# Altium schematic sheet Ctrl_board.SchDoc
size A3; SheetNumber: 1; SheetTotal: 1
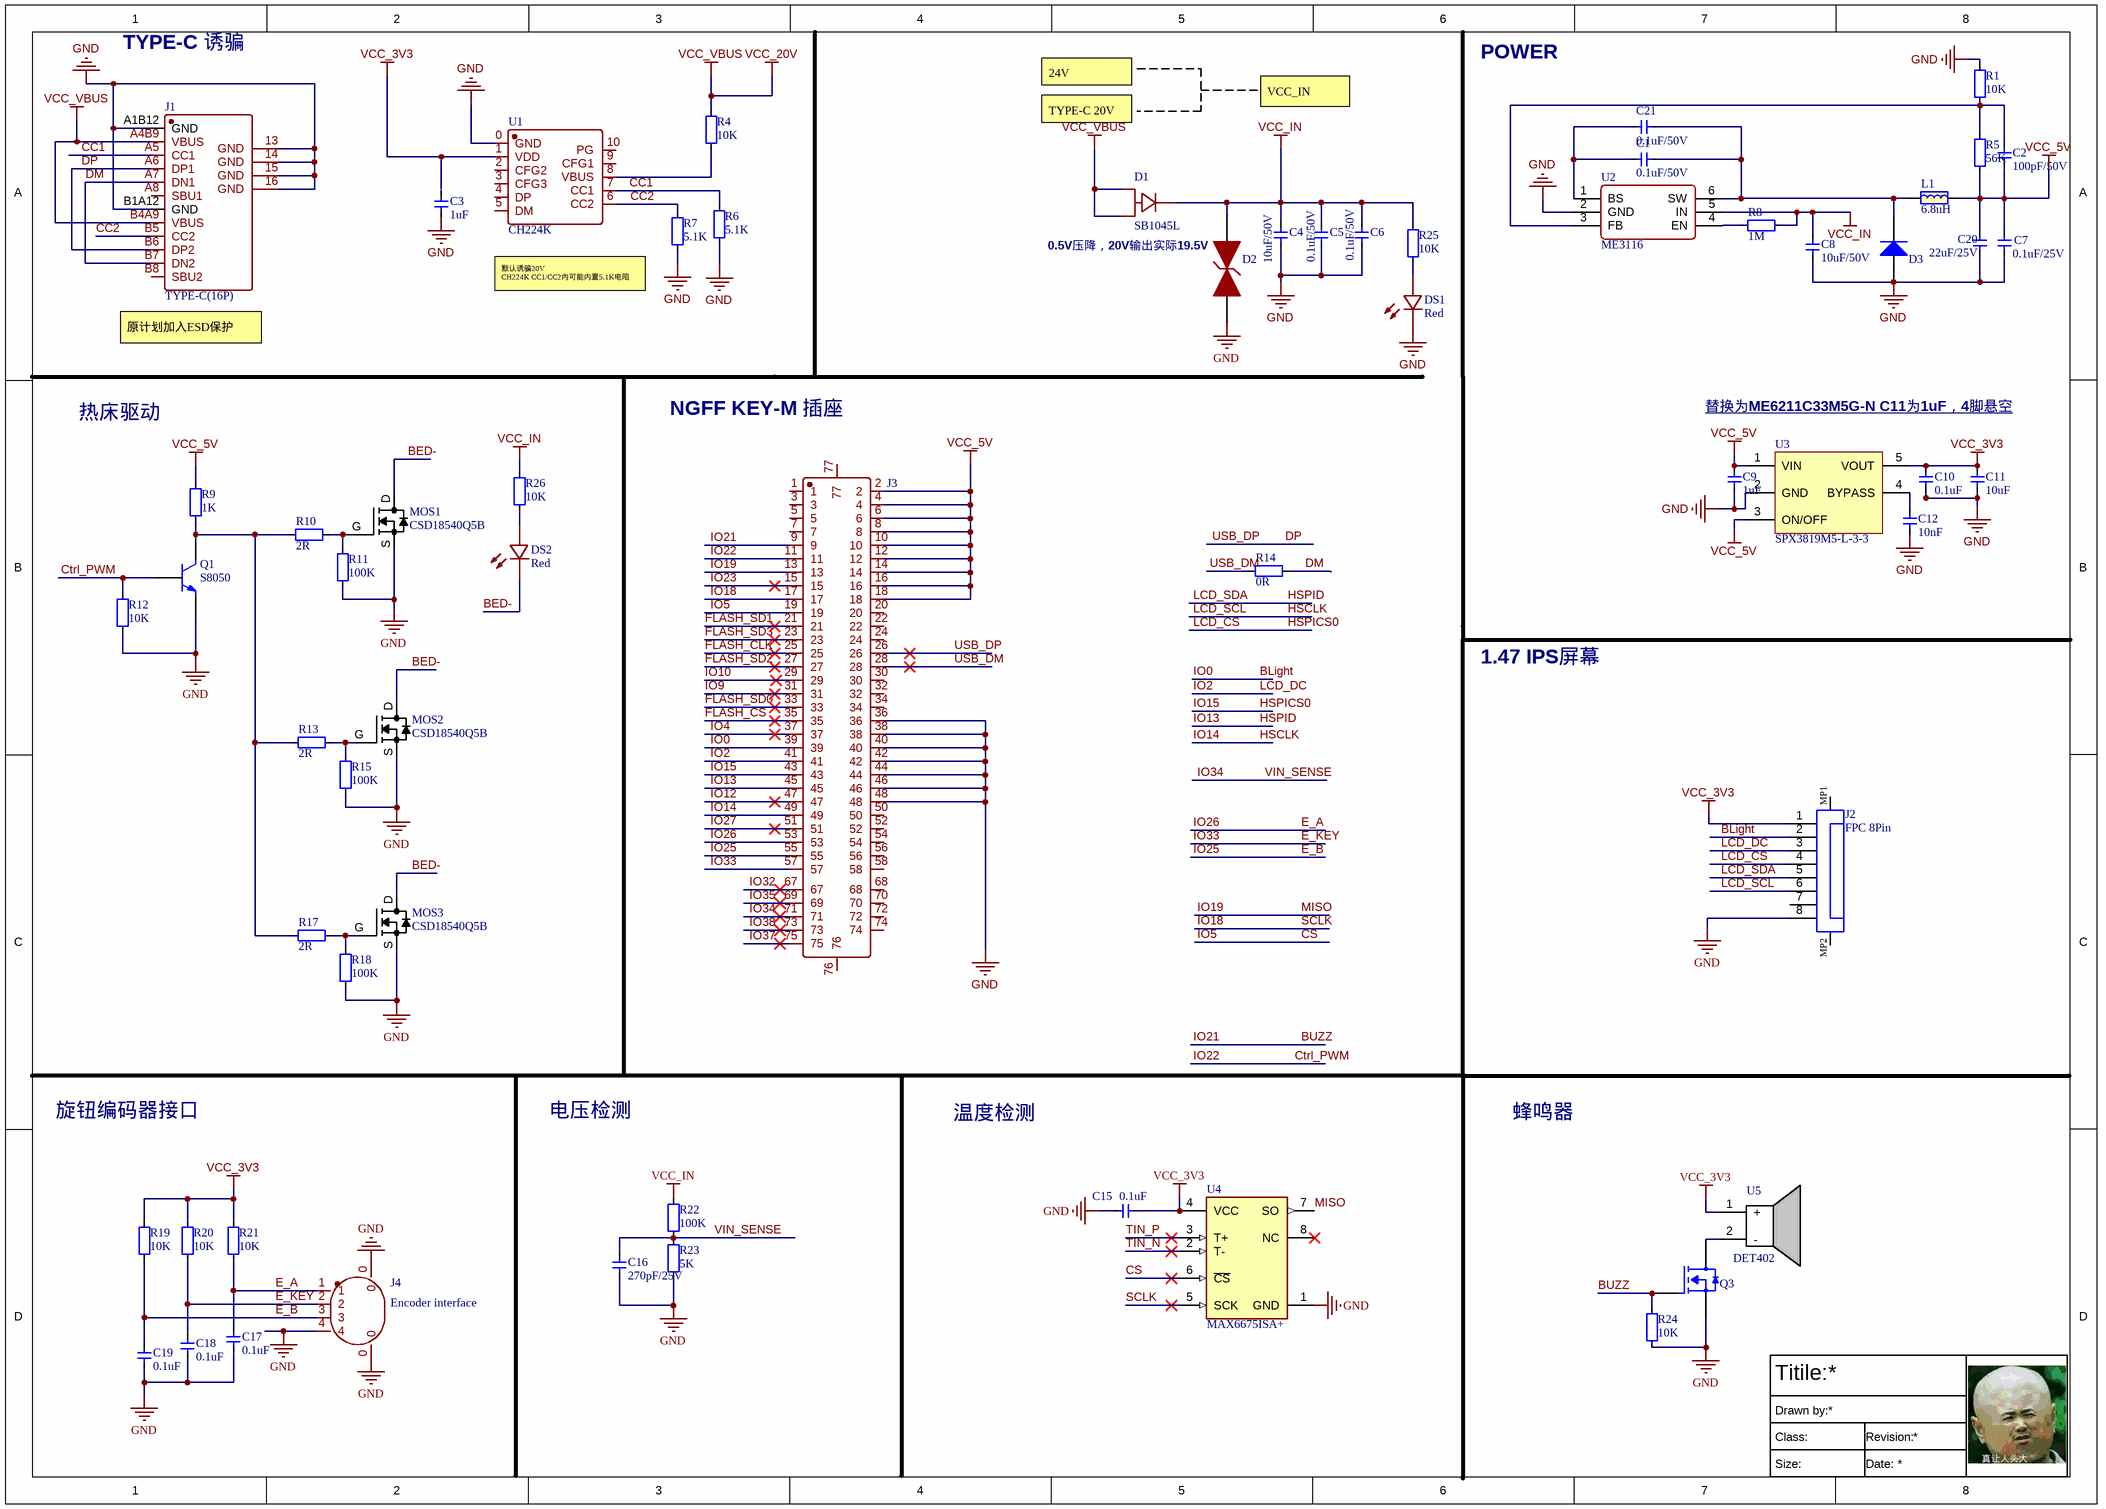
[diagram p0: Ctrl_board.SchDoc]

## Parts
C1  0.1uF/50V  [CAP_0402]
C2  100pF/50V  [CAP_0402]
C3  1uF  [CAP_0402]
C4  10uF/50V  [CAP-1206]
C5  0.1uF/50V  [CAP_0402]
C6  0.1uF/50V  [CAP_0402]
C7  0.1uF/25V  [CAP_0402]
C8  10uF/50V  [CAP-1206]
C9  1uF  [CAP_0402]
C10  0.1uF  [CAP_0402]
C11  10uF  [CAP_0402]
C12  10nF  [CAP_0402]
C15  0.1uF  [RES_0402]
C16  270pF/25V  [RES_0402]
C17  0.1uF  [CAP_0402]
C18  0.1uF  [CAP_0402]
C19  0.1uF  [CAP_0402]
C20  22uF/25V  [CAP_0805]
C21  0.1uF/50V  [CAP_0402]
D1  SB1045L  [TO-277]
D2  SMBJ28CA  [SMBJ-CA_MFG]  (value not drawn)
D3  二极管-5819W  [SOD-323]  (value not drawn)
DS1  Red  [LED_0402]
DS2  Red  [LED_0402]
J1  TYPE-C(16P)  [TYPE-C 16P]
J2  FPC 8Pin  [FPC 0.5MM 8P 1.0H]
J3  M.2 M_KEY 3.2H 4+5  [M.2 M-Key 3.2H 4+5]  (value not drawn)
J4  Encoder interface  [SH 1.0MM 4P]
L1  6.8uH  [IND-0420]
MOS1  CSD18540Q5B  [DFN5*6]
MOS2  CSD18540Q5B  [DFN5*6]
MOS3  CSD18540Q5B  [DFN5*6]
Q1  S8050  [SOT23-3]
Q3  AO3400A  [SOT23-3]  (value not drawn)
R1  10K  [RES_0402]
R4  10K  [RES_0402]
R5  56K  [RES_0402]
R6  5.1K  [RES_0402]
R7  5.1K  [RES_0402]
R8  1M  [RES_0402]
R9  1K  [RES_0402]
R10  2R  [RES_0402]
R11  100K  [RES_0402]
R12  10K  [RES_0402]
R13  2R  [RES_0402]
R14  0R  [RES_0402]
R15  100K  [RES_0402]
R17  2R  [RES_0402]
R18  100K  [RES_0402]
R19  10K  [RES_0402]
R20  10K  [RES_0402]
R21  10K  [RES_0402]
R22  100K  [RES_0402]
R23  5K  [RES_0402]
R24  10K  [RES_0402]
R25  10K  [RES_0402]
R26  10K  [RES_0402]
U1  CH224K  [ESSOP10]
U2  ME3116  [SOT23-6]
U3  SPX3819M5-L-3-3  [SOT23-5]
U4  Part Number: MAX6675ISA+  [SO-8]  (hidden comment: MAX6675ISA)
U5  DET402  [Buzzer 5020]

## Nets
GND: C3.1 C4.1 C5.1 C6.1 C7.1 C8.1 C9.1 C10.1 C11.1 C12.1 C15.2 C16.1 C17.1 C18.1 C19.1 C20.1 D2.1 D3.1(A) DS1.1(C) J1.13(GND) J1.14(GND) J1.15(GND) J1.16(GND) J1.A1B12(GND) J1.B1A12(GND) J2.8 J3.36 J3.38 J3.40 J3.42 J3.44 J3.46 J3.48 J4.0 J4.4 MOS1.S MOS2.S MOS3.S Q1.2(E) Q3.2(S) R1.2 R6.1 R7.1 R11.2 R12.2 R15.2 R18.2 R23.2 R24.1 U1.0(GND) U2.2(GND) U3.2(GND) U4.1(GND)
VCC_3V3: C10.2 C11.2 C15.1 J2.1 R19.1 R20.1 R21.1 U1.1(VDD) U3.5(VOUT) U4.4(VCC) U5.1(+)
VCC_5V: C2.1 C7.2 C9.2 C20.2 J3.2 J3.4 J3.6 J3.8 J3.10 J3.12 J3.14 J3.16 J3.18 L1.2 R5.1 R9.1 U3.1(VIN) U3.3(ON/OFF)
VCC_20V: D1.1(K) D1.2(K) J1.A4B9(VBUS) J1.B4A9(VBUS) R4.2  [also labelled VCC_VBUS]
VCC_IN: C4.2 C5.2 C6.2 C8.2 D1.3(A) D2.2 R8.2 R22.1 R25.2 R26.2 U2.5(IN)
BED-: DS2.1(C) MOS1.D MOS2.D MOS3.D
BLight: J2.2 J3.39  [also labelled IO0]
BUZZ: J3.9 Q3.1(G) R24.2  [also labelled IO21]
CC1: J1.A5(CC1) R6.2 U1.7(CC1)
CC2: J1.B5(CC2) R7.2 U1.6(CC2)
CS: J3.19 U4.6(~{CS})  [also labelled IO5]
Ctrl_PWM: J3.11 Q1.1(B) R12.1  [also labelled IO22]
DM: J1.A7(DN1) J1.B7(DN2) R14.2
DP: J1.A6(DP1) J1.B6(DP2) J3.26  [also labelled USB_DP]
E_A: C17.2 J3.53 J4.1 R21.2  [also labelled IO26]
E_B: C19.2 J3.55 J4.3 R19.2  [also labelled IO25]
E_KEY: C18.2 J3.57 J4.2 R20.2  [also labelled IO33]
FLASH_CLK: J3.25
FLASH_CS: J3.35
FLASH_SD0: J3.33
FLASH_SD1: J3.21
FLASH_SD2: J3.27
FLASH_SD3: J3.23
HSCLK: J2.6 J3.49  [also labelled IO14, LCD_SCL]
HSPICS0: J2.4 J3.43  [also labelled IO15, LCD_CS]
HSPID: J2.5 J3.45  [also labelled IO13, LCD_SDA]
IO2: J2.3 J3.41  [also labelled LCD_DC]
IO4: J3.37
IO9: J3.31
IO10: J3.29
IO12: J3.47
IO18: J3.17 U4.5(SCK)  [also labelled SCLK]
IO19: J3.13 U4.7(SO)  [also labelled MISO]
IO23: J3.15
IO27: J3.51
IO32: J3.67
IO34: C16.2 J3.71 R22.2 R23.1  [also labelled VIN_SENSE]
IO35: J3.69
IO37: J3.75
IO38: J3.73
TIN_N: U4.2(T-)
TIN_P: U4.3(T+)
USB_DM: J3.28 R14.1
NetC1_1: C1.1 C21.1 D3.2(K) L1.1 U2.6(SW)
NetC1_2: C1.2 C21.2 U2.1(BS)
NetC2_2: C2.2 R1.1 R5.2 U2.3(FB)
NetC12_2: C12.2 U3.4(BYPASS)
NetDS1_2: DS1.2(A) R25.1
NetDS2_2: DS2.2(A) R26.1
NetMOS1_G: MOS1.G R10.2 R11.1
NetMOS2_G: MOS2.G R13.2 R15.1
NetMOS3_G: MOS3.G R17.2 R18.1
NetQ1_3: Q1.3(C) R9.2 R10.1 R13.1 R17.1
NetQ3_3: Q3.3(D) U5.2(-)
NetR4_1: R4.1 U1.8(VBUS)
NetR8_1: R8.1 U2.4(EN)

Not connected (* = marked no-connect by the designer): C3 2; J1 A8(SBU1) B8(SBU2); J2 7 MP1 MP2; J3 1 3 5 7 20 22 24 30 32 34 50 52 54 56 58 68 70 72 74 76 77; U1 2(CFG2) 3(CFG3) 4(DP) 5(DM) 9(CFG1) 10(PG); U4 8(NC)*

## Notes on the sheet
- TYPE-C 诱骗
- 24V
- VCC_IN
- POWER
- TYPE-C 20V
- (near D1) 0.5V压降，20V输出实际19.5V
- 默认诱骗20V
  CH224K CC1/CC2内可能内置5.1K电阻
- (near J1) 原计划加入ESD保护
- 热床驱动
- NGFF KEY-M 插座
- 替换为ME6211C33M5G-N C11为1uF，4脚悬空 <https://item.taobao.com/item.htm?spm=a1z10.3-c-s.w4002-21223910208.12.14076a4b6jT4Yt&id=572750408153>
- 1.47 IPS屏幕
- 旋钮编码器接口
- 电压检测
- 温度检测
- 蜂鸣器
- Titile:
- Drawn by:
- Class:
- Revision:
- Size:
- Date:

## Library data of the parts
C1-C12 C15-C21 = 电容-0402: Capacitor; Value: 0.1u
D1 = SB1045L: 肖特基二极管 40V 10A
D3 = 二极管-5819W: 40V
DS1 DS2 = LED_Red
J3 = M.2 M_KEY 3.2H 4+5: M-KEY 底座
J4 = SH 1.0MM 4P: 1.0MM间距 4P立贴插座
L1 = 电感-0420
MOS1-MOS3 = CSD18540Q5B: MOSFET N-CH 60V 100A TI
Q1 = S8050: NPN
Q3 = AO3400A: N-MOS
R1 R4-R15 R17-R26 = 电阻-0402: Resistor; Value: 22R
U2 = ME3116: DC-DC
U3 = LP2992: LDO
U4 = MAX6675ISA: IC THERMOCOUP TO DGTL 8-SOIC; Manufacturer: Maxim Electronics; Category 9E07530Daf1645C0: Semiconductors and Actives; Category 3Cb8F1B20D37E77F: Sensors (Acceleration, Pressure, ...); Category 8A76477Cb9Bd51B1: Temperature Control and Regulation; Category 84F649Fcb0Ed5F31: Uncategorized; max_supply_voltage_dc: 5.50V; Category D46C1966E09E0Fab: Temperature; Category Db391633E8F300Fe: Industrial Control; Category C33B0E31F09B18Fc: Temperature Sensor ICs; Mfg Package Ident: 21-0041; Category E95E2454Daf93299: Temperature Sensing/Measurement; Category 2Fc5E2Cf1B85F402: Interface ICs; Category 6B95A69F5F75B052: Sensors and Accessories; Symbol 0 0: Standard; Num Pins: 8; supply_current: 0.70 mA; helpURL: https://upverter.com/upn/revision/df8f98e99e77f28c/; ComponentLink2Description: Datasheet; Temperature: -20°C to +85°C; Package: 21-0041; Supplier 2: Mouser; Supplier 1: Digi-Key; ComponentLink1URL: https://upverter.com/upn/revision/df8f98e99e77f28c/; Supplier Part Number 2: 700-MAX6675ISA; Supplier Part Number 1: MAX6675ISA+-ND; ComponentLink1Description: Upverter; ComponentLink2URL: https://upverter.com/datasheet/328f41e80cd5fba93d602566d8324382201f26da.pdf; RoHS: TRUE; Temperature Range High: +85°C; Octopart Part Number: 33bcfab92ad8ec7b; Digikey Description: IC THERMOCOUP TO DGTL 8-SOIC; Digikey Part Number: MAX6675ISA+-ND; Lead Free: yes; Type: integrated circuit; Category 20B3Edb914A9Fb74: Uncategorized; Mouser Part Number: 700-MAX6675ISA; Temperature Range Low: -20°C; Category 3B3Df6370Ab4E0Fa: Temperature Sensor ICs; Mounting Type: surface mount; Ipc Land Pattern Name: SOIC127P600X155-8